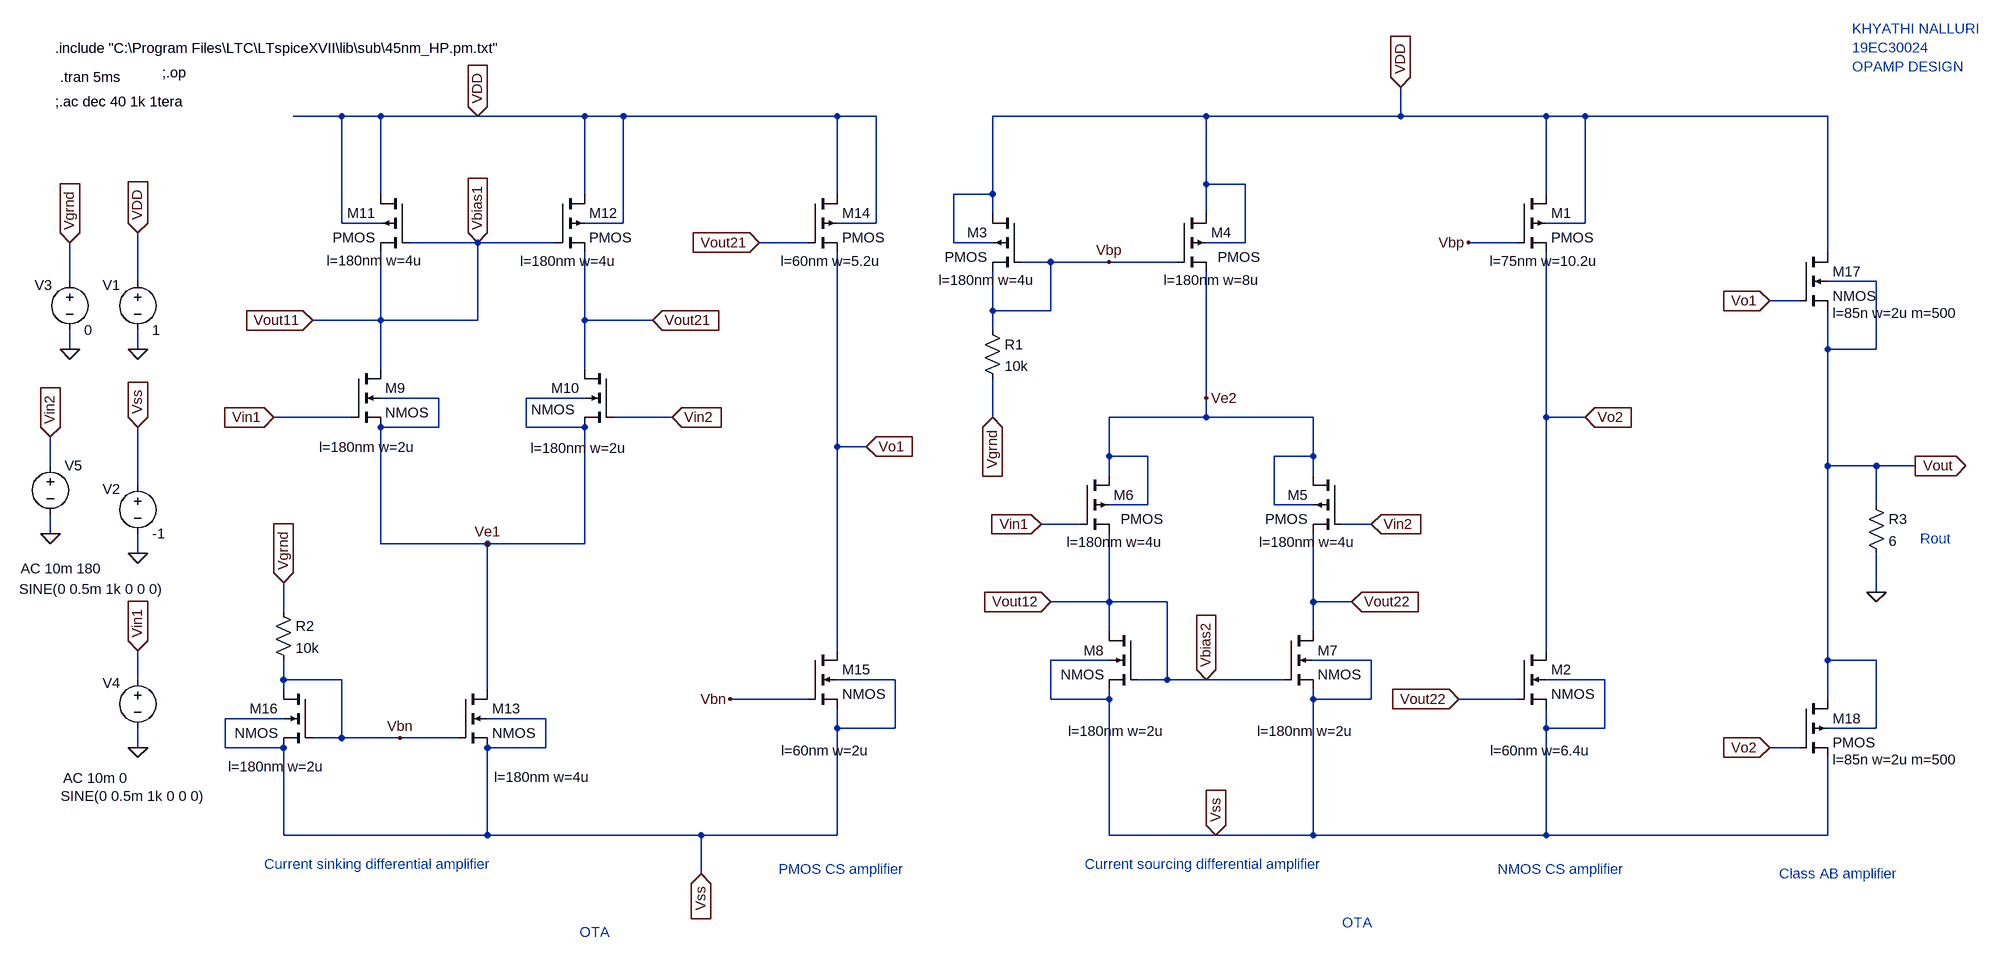
[diagram p0: schematic Final_opamp_19EC30024.asc]
Final_opamp_19EC30024.asc, the LTspice schematic file:
Version 4
SHEET 1 1840 988
WIRE -1072 -512 -1152 -512
WIRE -1008 -512 -1072 -512
WIRE -848 -512 -1008 -512
WIRE -672 -512 -848 -512
WIRE -608 -512 -672 -512
WIRE -256 -512 -608 -512
WIRE -192 -512 -256 -512
WIRE 352 -512 0 -512
WIRE 672 -512 672 -560
WIRE 672 -512 352 -512
WIRE 912 -512 672 -512
WIRE 976 -512 912 -512
WIRE 1376 -512 976 -512
WIRE 352 -400 352 -512
WIRE 416 -400 352 -400
WIRE -1008 -384 -1008 -512
WIRE -672 -384 -672 -512
WIRE -256 -384 -256 -512
WIRE 0 -384 0 -512
WIRE 0 -384 -64 -384
WIRE 912 -384 912 -512
WIRE 0 -352 0 -384
WIRE 352 -352 352 -400
WIRE -1072 -336 -1072 -512
WIRE -1008 -336 -1072 -336
WIRE -608 -336 -608 -512
WIRE -608 -336 -672 -336
WIRE -192 -336 -192 -512
WIRE -192 -336 -256 -336
WIRE 976 -336 976 -512
WIRE 976 -336 912 -336
WIRE -848 -304 -960 -304
WIRE -720 -304 -848 -304
WIRE -304 -304 -384 -304
WIRE -64 -304 -64 -384
WIRE 0 -304 -64 -304
WIRE 416 -304 416 -400
WIRE 416 -304 352 -304
WIRE 864 -304 784 -304
WIRE 1376 -288 1376 -512
WIRE 96 -272 48 -272
WIRE 192 -272 96 -272
WIRE 304 -272 192 -272
WIRE -1520 -240 -1520 -304
WIRE -1408 -240 -1408 -320
WIRE 1456 -240 1376 -240
WIRE 1328 -208 1280 -208
WIRE 0 -192 0 -256
WIRE 96 -192 96 -272
WIRE 96 -192 0 -192
WIRE -1008 -176 -1008 -288
WIRE -1008 -176 -1120 -176
WIRE -848 -176 -848 -304
WIRE -848 -176 -1008 -176
WIRE -672 -176 -672 -288
WIRE -560 -176 -672 -176
WIRE 0 -160 0 -192
WIRE -1520 -128 -1520 -160
WIRE -1408 -128 -1408 -160
WIRE 1376 -128 1376 -192
WIRE 1456 -128 1456 -240
WIRE 1456 -128 1376 -128
WIRE -1008 -96 -1008 -176
WIRE -672 -96 -672 -176
WIRE -912 -48 -1008 -48
WIRE -672 -48 -768 -48
WIRE 352 -48 352 -256
WIRE -1056 -16 -1184 -16
WIRE -528 -16 -624 -16
WIRE 0 -16 0 -80
WIRE 352 -16 352 -48
WIRE 352 -16 192 -16
WIRE 528 -16 352 -16
WIRE 912 -16 912 -288
WIRE 976 -16 912 -16
WIRE -912 0 -912 -48
WIRE -912 0 -1008 0
WIRE -768 0 -768 -48
WIRE -672 0 -768 0
WIRE -256 32 -256 -288
WIRE -208 32 -256 32
WIRE 192 48 192 -16
WIRE 256 48 192 48
WIRE 528 48 528 -16
WIRE 528 48 464 48
WIRE -1552 64 -1552 16
WIRE 1376 64 1376 -128
WIRE 1456 64 1376 64
WIRE 1520 64 1456 64
WIRE 192 80 192 48
WIRE 528 80 528 48
WIRE -1408 96 -1408 0
WIRE 256 128 256 48
WIRE 256 128 192 128
WIRE 464 128 464 48
WIRE 528 128 464 128
WIRE 1456 128 1456 64
WIRE 144 160 80 160
WIRE 624 160 576 160
WIRE -1552 176 -1552 144
WIRE -1008 192 -1008 0
WIRE -832 192 -1008 192
WIRE -672 192 -672 0
WIRE -672 192 -832 192
WIRE -1408 208 -1408 176
WIRE 1456 272 1456 208
WIRE 192 288 192 176
WIRE 192 288 96 288
WIRE 288 288 192 288
WIRE 528 288 528 176
WIRE 592 288 528 288
WIRE -1168 304 -1168 256
WIRE 192 336 192 288
WIRE 528 336 528 288
WIRE -256 368 -256 32
WIRE 912 368 912 -16
WIRE 192 384 96 384
WIRE 624 384 528 384
WIRE 1376 384 1376 64
WIRE 1456 384 1376 384
WIRE -1408 416 -1408 368
WIRE -1168 416 -1168 384
WIRE -1072 416 -1168 416
WIRE -160 416 -256 416
WIRE 288 416 288 288
WIRE 288 416 240 416
WIRE 352 416 288 416
WIRE 480 416 352 416
WIRE 1008 416 912 416
WIRE -1168 432 -1168 416
WIRE -832 432 -832 192
WIRE -304 448 -432 448
WIRE 96 448 96 384
WIRE 192 448 192 432
WIRE 192 448 96 448
WIRE 528 448 528 432
WIRE 624 448 624 384
WIRE 624 448 528 448
WIRE 864 448 768 448
WIRE 1376 448 1376 384
WIRE -1168 480 -1264 480
WIRE -736 480 -832 480
WIRE -256 496 -256 464
WIRE -160 496 -160 416
WIRE -160 496 -256 496
WIRE 912 496 912 464
WIRE 1008 496 1008 416
WIRE 1008 496 912 496
WIRE 1456 496 1456 384
WIRE 1456 496 1376 496
WIRE -1072 512 -1072 416
WIRE -1072 512 -1120 512
WIRE -976 512 -1072 512
WIRE -880 512 -976 512
WIRE -1408 528 -1408 496
WIRE -1264 528 -1264 480
WIRE -1168 528 -1264 528
WIRE -736 528 -736 480
WIRE -736 528 -832 528
WIRE 1328 528 1280 528
WIRE -1168 672 -1168 528
WIRE -832 672 -832 528
WIRE -832 672 -1168 672
WIRE -480 672 -832 672
WIRE -256 672 -256 496
WIRE -256 672 -480 672
WIRE 192 672 192 448
WIRE 368 672 192 672
WIRE 528 672 528 448
WIRE 528 672 368 672
WIRE 912 672 912 496
WIRE 912 672 528 672
WIRE 1376 672 1376 544
WIRE 1376 672 912 672
WIRE -480 736 -480 672
FLAG 192 -272 Vbp
FLAG 768 448 Vout22
IOPIN 768 448 In
FLAG 976 -16 Vo2
IOPIN 976 -16 In
FLAG 80 160 Vin1
IOPIN 80 160 In
FLAG 624 160 Vin2
IOPIN 624 160 In
FLAG 592 288 Vout22
IOPIN 592 288 In
FLAG 96 288 Vout12
IOPIN 96 288 In
FLAG 352 -48 Ve2
FLAG 672 -560 VDD
IOPIN 672 -560 In
FLAG 0 -16 Vgrnd
IOPIN 0 -16 In
FLAG 352 416 Vbias2
IOPIN 352 416 In
FLAG 368 672 Vss
IOPIN 368 672 In
FLAG 784 -304 Vbp
FLAG -1184 -16 Vin1
IOPIN -1184 -16 In
FLAG -848 -304 Vbias1
IOPIN -848 -304 In
FLAG -528 -16 Vin2
IOPIN -528 -16 In
FLAG -848 -512 VDD
IOPIN -848 -512 In
FLAG -1408 -128 0
FLAG -1408 -320 VDD
IOPIN -1408 -320 In
FLAG -560 -176 Vout21
IOPIN -560 -176 In
FLAG -1120 -176 Vout11
IOPIN -1120 -176 In
FLAG -1408 208 0
FLAG -1408 0 Vss
IOPIN -1408 0 In
FLAG -1520 -128 0
FLAG -1520 -304 Vgrnd
IOPIN -1520 -304 In
FLAG -480 736 Vss
IOPIN -480 736 In
FLAG -1408 528 0
FLAG -1408 368 Vin1
IOPIN -1408 368 In
FLAG -1552 176 0
FLAG -1552 16 Vin2
IOPIN -1552 16 In
FLAG -832 192 Ve1
FLAG -976 512 Vbn
FLAG -432 448 Vbn
FLAG -384 -304 Vout21
IOPIN -384 -304 In
FLAG -1168 256 Vgrnd
IOPIN -1168 256 In
FLAG -208 32 Vo1
IOPIN -208 32 In
FLAG 1280 -208 Vo1
IOPIN 1280 -208 In
FLAG 1280 528 Vo2
IOPIN 1280 528 In
FLAG 1520 64 Vout
IOPIN 1520 64 Out
FLAG 1456 272 0
SYMBOL pmos4 864 -384 R0
WINDOW 123 -45 111 Left 2
SYMATTR Value2 l=75nm w=10.2u
SYMATTR InstName M1
SYMBOL nmos4 864 368 R0
WINDOW 123 -44 165 Left 2
SYMATTR Value2 l=60nm w=6.4u
SYMATTR InstName M2
SYMBOL res -16 -176 R0
SYMATTR InstName R1
SYMATTR Value 10k
SYMBOL pmos4 48 -352 M0
WINDOW 123 -22 110 Left 2
SYMATTR Value2 l=180nm w=4u
SYMATTR InstName M3
SYMBOL pmos4 304 -352 R0
WINDOW 123 -22 110 Left 2
WINDOW 3 67 72 Left 2
SYMATTR Value2 l=180nm w=8u
SYMATTR InstName M4
SYMBOL pmos4 576 80 M0
WINDOW 123 -22 110 Left 2
SYMATTR Value2 l=180nm w=4u
SYMATTR InstName M5
SYMBOL pmos4 144 80 R0
WINDOW 123 -22 110 Left 2
WINDOW 3 67 72 Left 2
SYMATTR Value2 l=180nm w=4u
SYMATTR InstName M6
SYMBOL nmos4 480 336 R0
WINDOW 123 -44 165 Left 2
SYMATTR Value2 l=180nm w=2u
SYMATTR InstName M7
SYMBOL nmos4 240 336 M0
WINDOW 123 -44 165 Left 2
SYMATTR Value2 l=180nm w=2u
SYMATTR InstName M8
SYMBOL nmos4 -1056 -96 R0
WINDOW 123 -53 129 Left 2
SYMATTR Value2 l=180nm w=2u
SYMATTR InstName M9
SYMBOL nmos4 -624 -96 M0
WINDOW 3 64 67 Left 2
WINDOW 123 -22 131 Left 2
SYMATTR Value2 l=180nm w=2u
SYMATTR InstName M10
SYMBOL pmos4 -960 -384 M0
WINDOW 123 -22 110 Left 2
SYMATTR Value2 l=180nm w=4u
SYMATTR InstName M11
SYMBOL pmos4 -720 -384 R0
WINDOW 123 -58 111 Left 2
SYMATTR Value2 l=180nm w=4u
SYMATTR InstName M12
SYMBOL voltage -1408 -256 R0
WINDOW 0 -58 22 Left 2
WINDOW 123 0 0 Left 0
WINDOW 39 0 0 Left 0
SYMATTR InstName V1
SYMATTR Value 1
SYMBOL voltage -1408 80 R0
WINDOW 0 -58 22 Left 2
WINDOW 123 0 0 Left 0
WINDOW 39 0 0 Left 0
SYMATTR InstName V2
SYMATTR Value -1
SYMBOL nmos4 -880 432 R0
WINDOW 123 59 145 Left 2
SYMATTR Value2 l=180nm w=4u
SYMATTR InstName M13
SYMBOL voltage -1520 -256 R0
WINDOW 0 -58 22 Left 2
WINDOW 123 0 0 Left 0
WINDOW 39 0 0 Left 0
SYMATTR InstName V3
SYMATTR Value 0
SYMBOL voltage -1408 400 R0
WINDOW 0 -58 22 Left 2
WINDOW 3 -127 208 Left 2
WINDOW 123 -123 178 Left 2
WINDOW 39 0 0 Left 0
SYMATTR InstName V4
SYMATTR Value SINE(0 0.5m 1k 0 0 0)
SYMATTR Value2 AC 10m 0
SYMBOL voltage -1552 48 R0
WINDOW 123 -49 185 Left 2
WINDOW 39 0 0 Left 0
WINDOW 3 -51 219 Left 2
SYMATTR Value2 AC 10m 180
SYMATTR Value SINE(0 0.5m 1k 0 0 0)
SYMATTR InstName V5
SYMBOL pmos4 -304 -384 R0
WINDOW 123 -45 111 Left 2
SYMATTR Value2 l=60nm w=5.2u
SYMATTR InstName M14
SYMBOL nmos4 -304 368 R0
WINDOW 123 -44 165 Left 2
SYMATTR Value2 l=60nm w=2u
SYMATTR InstName M15
SYMBOL nmos4 -1120 432 M0
WINDOW 123 -20 127 Left 2
SYMATTR Value2 l=180nm w=2u
SYMATTR InstName M16
SYMBOL res -1184 288 R0
SYMATTR InstName R2
SYMATTR Value 10k
SYMBOL nmos4 1328 -288 R0
WINDOW 123 56 100 Left 2
SYMATTR Value2 l=85n w=2u m=500
SYMATTR InstName M17
SYMBOL pmos4 1328 448 R0
WINDOW 123 56 100 Left 2
SYMATTR Value2 l=85n w=2u m=500
SYMATTR InstName M18
SYMBOL res 1440 112 R0
SYMATTR InstName R3
SYMATTR Value 6
TEXT -1536 -576 Left 2 !.tran 5ms
TEXT -1544 -536 Left 2 !;.ac dec 40 1k 1tera
TEXT -1544 -624 Left 2 !.include "C:\\Program Files\\LTC\\LTspiceXVII\\lib\\sub\\45nm_HP.pm.txt"
TEXT -1368 -584 Left 2 !;.op
TEXT -1200 720 Left 2 ;Current sinking differential amplifier
TEXT 152 720 Left 2 ;Current sourcing differential amplifier
TEXT 1296 736 Left 2 ;Class AB amplifier
TEXT 1528 184 Left 2 ;Rout
TEXT -352 728 Left 2 ;PMOS CS amplifier
TEXT 832 728 Left 2 ;NMOS CS amplifier
TEXT 1416 -656 Left 2 ;KHYATHI NALLURI\n19EC30024\nOPAMP DESIGN
TEXT -680 832 Left 2 ;OTA
TEXT 576 816 Left 2 ;OTA

The netlist it stands for:
* Final_opamp_19EC30024.asc
M1 VDD Vbp Vo2 VDD PMOS l=75nm w=10.2u
M2 Vo2 Vout22 Vss Vss NMOS l=60nm w=6.4u
R1 Vbp Vgrnd 10k
M3 VDD Vbp Vbp VDD PMOS l=180nm w=4u
M4 VDD Vbp Ve2 VDD PMOS l=180nm w=8u
M5 Ve2 Vin2 Vout22 Ve2 PMOS l=180nm w=4u
M6 Ve2 Vin1 Vbias2 Ve2 PMOS l=180nm w=4u
M7 Vout22 Vbias2 Vss Vss NMOS l=180nm w=2u
M8 Vbias2 Vbias2 Vss Vss NMOS l=180nm w=2u
M9 Vout11 Vin1 Ve1 Ve1 NMOS l=180nm w=2u
M10 Vout21 Vin2 Ve1 Ve1 NMOS l=180nm w=2u
M11 VDD Vout11 Vout11 VDD PMOS l=180nm w=4u
M12 VDD Vout11 Vout21 VDD PMOS l=180nm w=4u
V1 VDD 0 1
V2 Vss 0 -1
M13 Ve1 Vbn Vss Vss NMOS l=180nm w=4u
V3 Vgrnd 0 0
V4 Vin1 0 SINE(0 0.5m 1k 0 0 0) AC 10m 0
V5 Vin2 0 SINE(0 0.5m 1k 0 0 0) AC 10m 180
M14 VDD Vout21 Vo1 VDD PMOS l=60nm w=5.2u
M15 Vo1 Vbn Vss Vss NMOS l=60nm w=2u
M16 Vbn Vbn Vss Vss NMOS l=180nm w=2u
R2 Vgrnd Vbn 10k
M17 VDD Vo1 Vout Vout NMOS l=85n w=2u m=500
M18 Vout Vo2 Vss Vout PMOS l=85n w=2u m=500
R3 Vout 0 6
.model NMOS NMOS
.model PMOS PMOS
.lib standard.mos
.tran 5ms
;.ac dec 40 1k 1tera
.include "C:\Program Files\LTC\LTspiceXVII\lib\sub\45nm_HP.pm.txt"
;.op
* Current sinking differential amplifier
* Current sourcing differential amplifier
* Class AB amplifier
* Rout
* PMOS CS amplifier
* NMOS CS amplifier
* KHYATHI NALLURI
* 19EC30024
* OPAMP DESIGN
* OTA
* OTA
.backanno
.end